# EAGLE design POC-save (EAGLE 7.6.0)
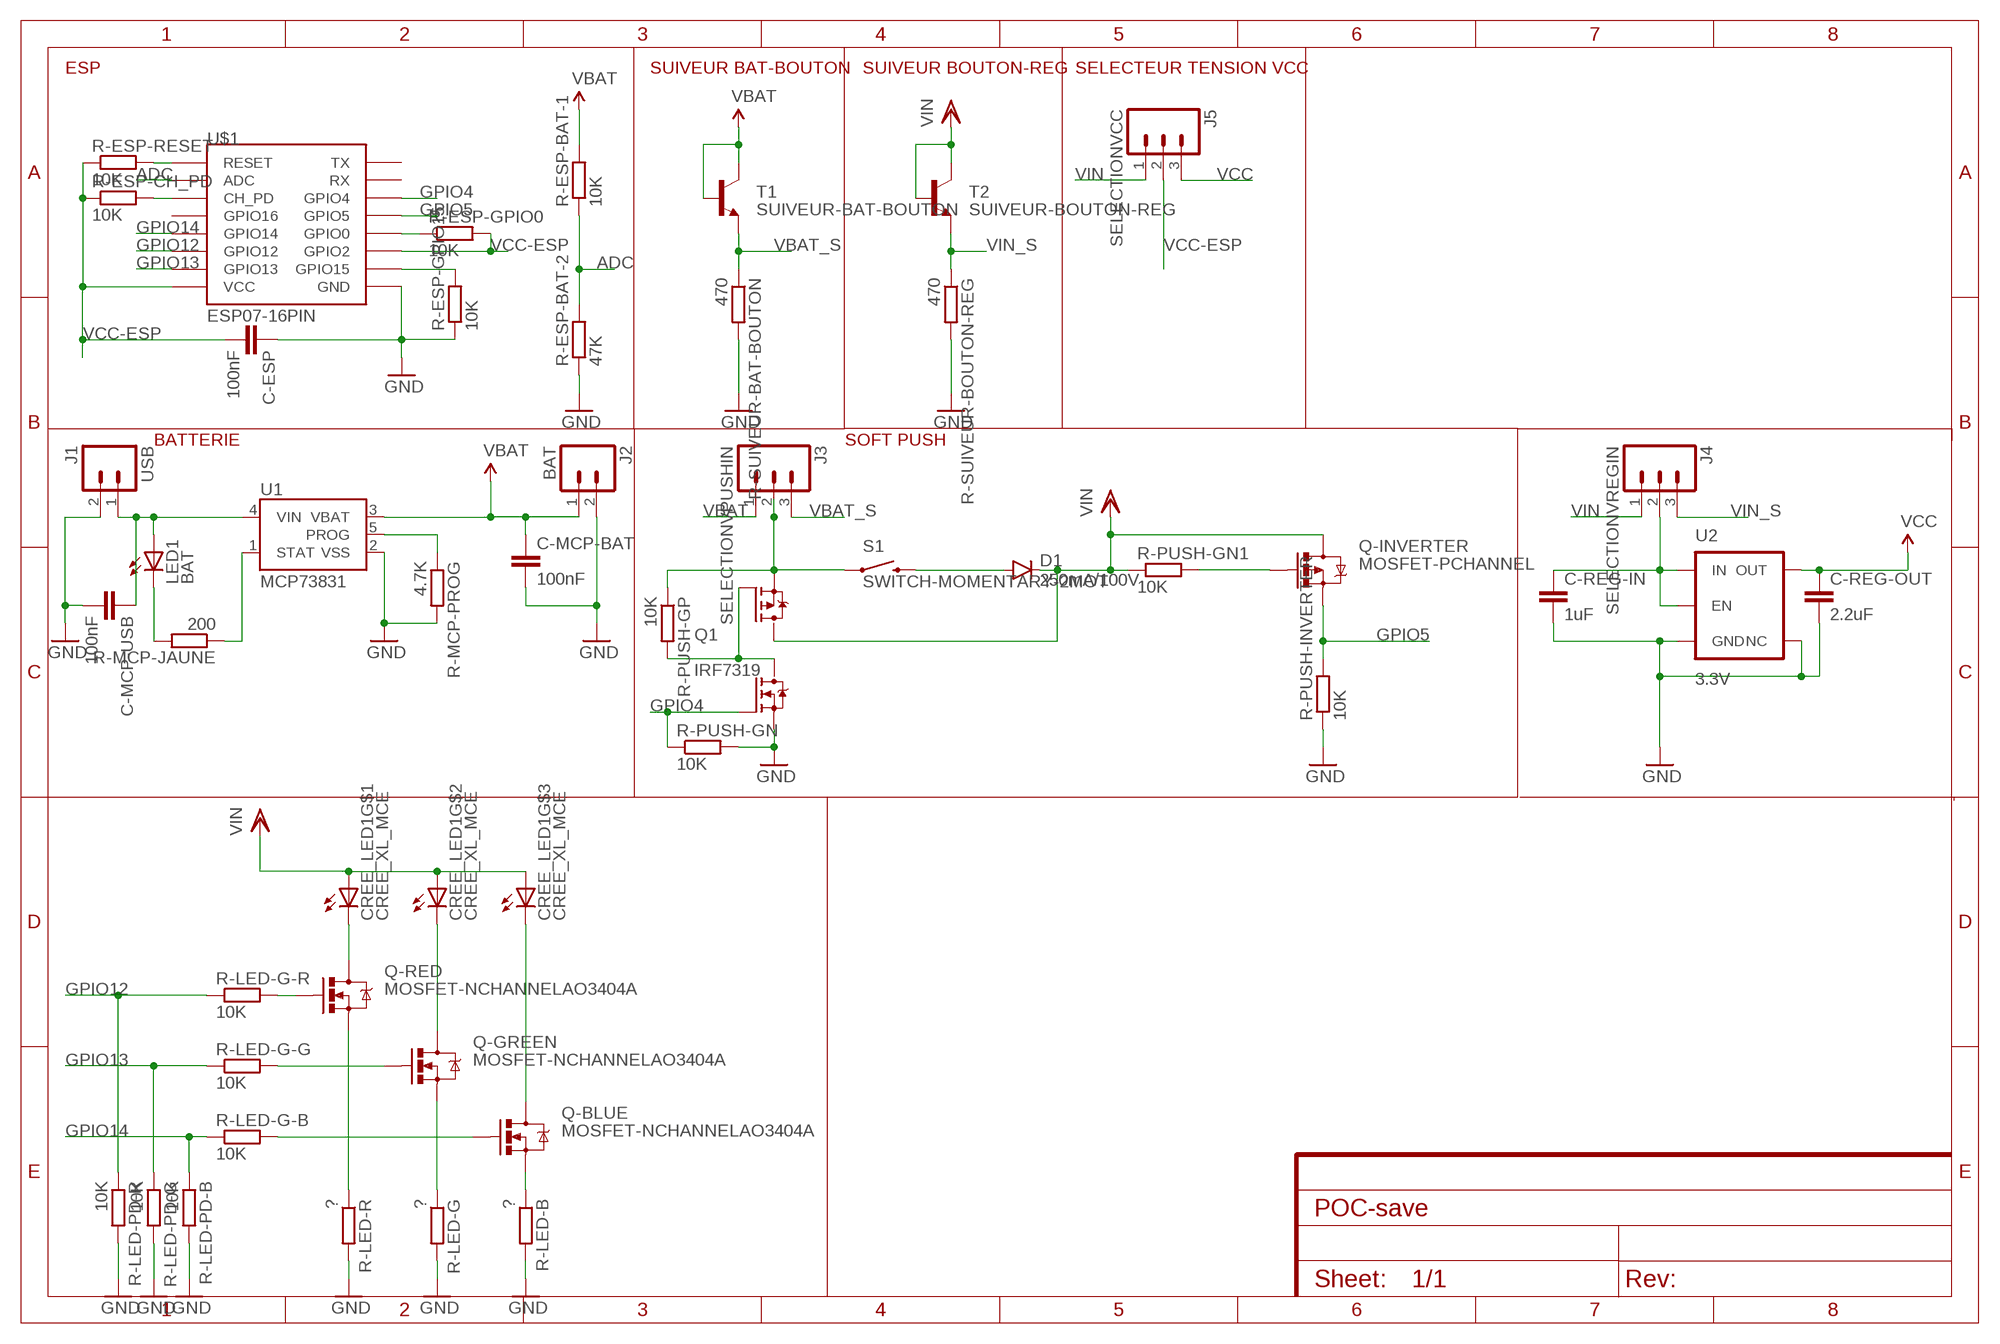
[diagram p0: schematic, sheet 1]

## Parts
C-ESP  100nF  C-EUC0805  [C0805]
C-MCP-BAT  100nF  C-EUC0805  [C0805]
C-MCP-USB  100nF  C-EUC0805  [C0805]
C-REG-IN  1uF  C-EUC0805  [C0805]
C-REG-OUT  2.2uF  C-EUC0805  [C0805]
CREE_LED1  CREE_XL_MCE  [CREE_XL_MCE]
D1  250mA/100V  DIODEBAS16  [SOD-323]
J1  USB  M02PTH  [1X02]
J2  BAT  M02PTH  [1X02]
J3  SELECTIONVPUSHIN  M03PTH  [1X03]
J4  SELECTIONVREGIN  M03PTH  [1X03]
J5  SELECTIONVCC  M03PTH  [1X03]
LED1  BAT  LEDCHIPLED_0805  [CHIPLED_0805]
Q1  IRF7319  [SO08-IRF]
Q-BLUE  MOSFET-NCHANNELAO3404A  [SOT23-3]
Q-GREEN  MOSFET-NCHANNELAO3404A  [SOT23-3]
Q-INVERTER  MOSFET-PCHANNEL  [SOT23-3]
Q-RED  MOSFET-NCHANNELAO3404A  [SOT23-3]
R-ESP-BAT-1  10K  R-EU_M0805  [M0805]
R-ESP-BAT-2  47K  R-EU_M0805  [M0805]
R-ESP-CH_PD  10K  R-EU_M0805  [M0805]
R-ESP-GPIO0  10K  R-EU_M0805  [M0805]
R-ESP-GPIO15  10K  R-EU_M0805  [M0805]
R-ESP-RESET  10K  R-EU_M0805  [M0805]
R-LED-B  ?  R-EU_M0805  [M0805]
R-LED-G  ?  R-EU_M0805  [M0805]
R-LED-G-B  10K  R-EU_M0805  [M0805]
R-LED-G-G  10K  R-EU_M0805  [M0805]
R-LED-G-R  10K  R-EU_M0805  [M0805]
R-LED-PD-B  10K  R-EU_M0805  [M0805]
R-LED-PD-G  10K  R-EU_M0805  [M0805]
R-LED-PD-R  10K  R-EU_M0805  [M0805]
R-LED-R  ?  R-EU_M0805  [M0805]
R-MCP-JAUNE  200  R-EU_M0805  [M0805]
R-MCP-PROG  4.7K  R-EU_M0805  [M0805]
R-PUSH-GN  10K  R-EU_M0805  [M0805]
R-PUSH-GN1  10K  R-EU_M0805  [M0805]
R-PUSH-GP  10K  R-EU_M0805  [M0805]
R-PUSH-INVERTER  10K  R-EU_M0805  [M0805]
R-SUIVEUR-BAT-BOUTON  470  R-EU_M0805  [M0805]
R-SUIVEUR-BOUTON-REG  470  R-EU_M0805  [M0805]
S1  SWITCH-MOMENTARY-2MOT  [TACTILE-PTH]
T1  SUIVEUR-BAT-BOUTON  TRANSISTOR_NPNSOT23-3  [SOT23-3]
T2  SUIVEUR-BOUTON-REG  TRANSISTOR_NPNSOT23-3  [SOT23-3]
U1  MCP73831  [SOT23-5]
U2  3.3V  V_REG_AP2112K-3.3V  [SOT23-5]
U$1  ESP07-16PIN  [ESP07-16PIN]

## Nets
ADC: R-ESP-BAT-1.1 R-ESP-BAT-2.2 U$1.ADC
GND: C-ESP.1 C-MCP-BAT.2 C-MCP-USB.2 C-REG-IN.2 C-REG-OUT.2 J1.2 J2.2 Q1.1(N-S) R-ESP-BAT-2.1 R-ESP-GPIO15.1 R-LED-B.2 R-LED-G.2 R-LED-PD-B.2 R-LED-PD-G.2 R-LED-PD-R.2 R-LED-R.2 R-MCP-PROG.2 R-PUSH-GN.2 R-PUSH-INVERTER.1 R-SUIVEUR-BAT-BOUTON.2 R-SUIVEUR-BOUTON-REG.2 U1.2(VSS) U2.2(GND) U2.4(NC) U$1.GND
GPIO4: Q1.2(N-G) R-PUSH-GN.1 U$1.GPIO4
GPIO5: Q-INVERTER.2(S) R-PUSH-INVERTER.2 U$1.GPIO5
GPIO12: R-LED-G-R.1 R-LED-PD-R.1 U$1.GPIO12
GPIO13: R-LED-G-G.1 R-LED-PD-G.1 U$1.GPIO13
GPIO14: R-LED-G-B.1 R-LED-PD-B.1 U$1.GPIO14
N$1: R-ESP-GPIO15.2 U$1.GPIO15
N$2: R-ESP-GPIO0.1 U$1.GPIO0
N$4: R-ESP-CH_PD.2 U$1.CH_PD
N$5: R-ESP-RESET.2 U$1.REST(RESET)
N$6: R-MCP-PROG.1 U1.5(PROG)
N$7: R-MCP-JAUNE.1 U1.1(STAT)
N$8: LED1.C R-MCP-JAUNE.2
N$9: Q1.4(P-G) Q1.7(N-D) Q1.8(N-D) R-PUSH-GP.2
N$10 [SUPPLY]: D1.A S1.4
N$11: Q-INVERTER.1(G) R-PUSH-GN1.2
N$12: C-REG-IN.1 J4.2 U2.1(IN) U2.3(EN)
N$13 [SUPPLY]: CREE_LED1.8(C) Q-RED.3(D)
N$14 [SUPPLY]: CREE_LED1.7(C) Q-GREEN.3(D)
N$15 [SUPPLY]: CREE_LED1.6(C) Q-BLUE.3(D)
N$18 [SUPPLY]: Q-BLUE.2(S) R-LED-B.1
N$19 [SUPPLY]: Q-GREEN.2(S) R-LED-G.1
N$20 [SUPPLY]: Q-RED.2(S) R-LED-R.1
N$21: Q-RED.1(G) R-LED-G-R.2
N$22: Q-GREEN.1(G) R-LED-G-G.2
N$23: Q-BLUE.1(G) R-LED-G-B.2
VBAT [SUPPLY]: C-MCP-BAT.1 J2.1 J3.1 R-ESP-BAT-1.2 T1.1(B) T1.3(C) U1.3(VBAT)
VBAT_S [SUPPLY]: J3.3 R-SUIVEUR-BAT-BOUTON.1 T1.2(E)
VCC [SUPPLY]: C-REG-OUT.1 J5.3 U2.5(OUT)
VCC-ESP [SUPPLY]: C-ESP.2 J5.2 R-ESP-CH_PD.1 R-ESP-GPIO0.2 R-ESP-RESET.1 U$1.GPIO2 U$1.VCC
VIN [SUPPLY]: CREE_LED1.1(A) CREE_LED1.2(A) CREE_LED1.3(A) D1.C J4.1 J5.1 Q1.5(P-D) Q1.6(P-D) Q-INVERTER.3(D) R-PUSH-GN1.1 T2.1(B) T2.3(C)
VIN_S [SUPPLY]: J4.3 R-SUIVEUR-BOUTON-REG.1 T2.2(E)
VPUSH_IN [SUPPLY]: J3.2 Q1.3(P-S) R-PUSH-GP.1 S1.1
VUSB [SUPPLY]: C-MCP-USB.1 J1.1 LED1.A U1.4(VIN)
Unconnected: CREE_LED1.4(A) CREE_LED1.5(C) CREE_LED1.HT(TH:TH) U$1.GPIO16 U$1.RX U$1.TX

## Notes on the sheet
- ESP | SUIVEUR BAT-BOUTON | SUIVEUR BOUTON-REG | SELECTEUR TENSION VCC
- BATTERIE | SOFT PUSH

## Library data of the parts
C-ESP C-MCP-BAT C-MCP-USB C-REG-IN C-REG-OUT = resistor:C-EU: CAPACITOR, European symbol
CREE_LED1 = CreeXL-MC-E:CREE_XL_MCE: Cree® LED
D1 = SparkFun-DiscreteSemi:DIODE: Diode These are standard reverse protection diodes and small signal diodes. SMA package can handle up to about 1A. SOD-323 can handle about 200mA. What the SOD-323 package when ordering, there are some mfgs out there that are 5-pin packages.; PROD_ID: DIO-09646
J1 J2 = SparkFun-Connectors:M02: Standard 2-pin 0.1" header. Use with - straight break away headers ( PRT-00116) - right angle break away headers (PRT-00553) - swiss pins (PRT-00743) - machine pins (PRT-00117) - female headers (PRT-00115) Molex polarized connector foot print use with: PRT-08233 with associated crimp pins and housings. 2.54_SCREWTERM for use with PRT-10571. 3.5mm Screw Terminal footprints for PRT-08084 5mm Screw Terminal footprints for use with PRT-08432
J3-J5 = SparkFun-Connectors:M03: Header 3 Standard 3-pin 0.1" header. Use with straight break away headers (SKU : PRT-00116), right angle break away headers (PRT-00553), swiss pins (PRT-00743), machine pins (PRT-00117), and female headers (PRT-00115). Molex polarized connector foot print use with SKU : PRT-08232 with associated crimp pins and housings.
LED1 = led:LED: LED OSRAM: - CHIPLED LG R971, LG N971, LY N971, LG Q971, LY Q971, LO R971, LY R971 LH N974, LH R974 LS Q976, LO Q976, LY Q976 LO Q996 - Hyper CHIPLED LW Q18S LB Q993, LB Q99A, LB R99A - SideLED LS A670, LO A670, LY A670, LG A670, LP A670 LB A673, LV A673, LT A673, LW A673 LH A674 LY A675 LS A676, LA A676, LO A676, LY A676, LW A676 LS A679, LY A679, LG A679 - Hyper Micro SIDELED® LS Y876, LA Y876, LO Y876, LY Y876 LT Y87S - SmartLED LW L88C, LW L88S LB L89C, LB L89S, LG L890 LS L89K, LO L89K, LY L89K LS L896, LA L896, LO L896, LY L896 - TOPLED LS T670, LO T670, LY T670, LG T670, LP T670 LSG T670, LSP T670, LSY T670, LOP T670, LYG T670 LG T671, LOG T671, LSG T671 LB T673, LV T673, LT T673, LW T673 LH T674 LS T676, LA T676, LO T676, LY T676, LB T676, LH T676, LSB T676, LW T676 LB T67C, LV T67C, LT T67C, LS T67K, LO T67K, LY T67K, LW E67C LS E67B, LA E67B, LO E67B, LY E67B, LB E67C, LV E67C, LT E67C LW T67C LS T679, LY T679, LG T679 LS T770, LO T770, LY T770, LG T770, LP T770 LB T773, LV T773, LT T773, LW T773 LH T774 LS E675, LA E675, LY E675, LS T675 LS T776, LA T776, LO T776, LY T776, LB T776 LHGB T686 LT T68C, LB T68C - Hyper Mini TOPLED® LB M676 - Mini TOPLED Santana® LG M470 LS M47K, LO M47K, LY M47K Source: http://www.osram.convergy.de LUXEON: - LUMILED® LXK2-PW12-R00, LXK2-PW12-S00, LXK2-PW14-U00, LXK2-PW14-V00 LXK2-PM12-R00, LXK2-PM12-S00, LXK2-PM14-U00 LXK2-PE12-Q00, LXK2-PE12-R00, LXK2-PE12-S00, LXK2-PE14-T00, LXK2-PE14-U00 LXK2-PB12-K00, LXK2-PB12-L00, LXK2-PB12-M00, LXK2-PB14-N00, LXK2-PB14-P00, LXK2-PB14-Q00 LXK2-PR12-L00, LXK2-PR12-M00, LXK2-PR14-Q00, LXK2-PR14-R00 LXK2-PD12-Q00, LXK2-PD12-R00, LXK2-PD12-S00 LXK2-PH12-R00, LXK2-PH12-S00 LXK2-PL12-P00, LXK2-PL12-Q00, LXK2-PL12-R00 Source: www.luxeon.com KINGBRIGHT: KA-3528ASYC Source: www.kingbright.com
Q1 = lio:IRF7319: Complimentary Half Bridge HEXFET Power MOSFET Source: http://www.irf.com/product-info/datasheets/data/irf7319.pdf
Q-BLUE Q-GREEN Q-RED = SparkFun-DiscreteSemi:MOSFET-NCHANNEL: Common NMOSFET Parts MFG P/N Store ID Prod ID FDD8780 TRANS-09984 SI7820DN TRANS-11055 FDS6630A IC-08089 2N7002PW TRANS-11151 FQP30N06L COM-10213 TRANS-10060 BSS123LT1G TRANS-08345 BSS138 TRANS-00830 BS170 2N7000; PROD_ID: TRAN-12988
Q-INVERTER = SparkFun-DiscreteSemi:MOSFET-PCHANNEL: Generic PMOSFET IRLML2244 - TRANS-11153 (SOT-23 -20V -4.3A) (1.Gate 2.Source 3.Drain) FQP27P06 - COM-10349 <http://www.sparkfun.com/products/10349> (TO-220 -60V -27A) (1.Gate 2.Source 3.Drain); PROD_ID: TRANS-08285
R-ESP-BAT-1 R-ESP-BAT-2 R-ESP-CH_PD R-ESP-GPIO0 R-ESP-GPIO15 R-ESP-RESET R-LED-B R-LED-G R-LED-G-B R-LED-G-G R-LED-G-R R-LED-PD-B R-LED-PD-G R-LED-PD-R R-LED-R R-MCP-JAUNE R-MCP-PROG R-PUSH-GN R-PUSH-GN1 R-PUSH-GP R-PUSH-INVERTER R-SUIVEUR-BAT-BOUTON R-SUIVEUR-BOUTON-REG = resistor:R-EU_: RESISTOR, European symbol
S1 = SparkFun-Electromechanical:SWITCH-MOMENTARY-2: Various NO switches- pushbuttons, reed, etc
T1 T2 = SparkFun-DiscreteSemi:TRANSISTOR_NPN: Generic NPN BJT MMBT2222A - TRANS-08049 (SOT-23, 1A 40V) MPSA42 - TRANS-09116 (SOT-23, 500mA 300V) MMBT5088LT1G - TRANS-11160 (SOT-23, 50 mA 30V) BC547 - COM-08928 <http://www.sparkfun.com/products/8928> (TO-92 45V 100mA) (1.Collector 2.Base 3.Emitter) 2N3904 - COM-00521 <http://www.sparkfun.com/products/521> (TO-92 40V 200mA) (1.Emitter 2.Base 3.Collector) P2N2222A - COM-12852 <http://www.sparkfun.com/products/12852> (TO-92 40V 600mA) (1.Collector 2.Base 3.Emitter); PROD_ID: TRANS-08049
U1 = SparkFun-PowerIC:MCP73831: Miniature single cell, fully integrated Li-Ion, Li-polymer charge management controller http://ww1.microchip.com/downloads/en/DeviceDoc/20001984g.pdf IC-09995; PROD_ID: IC-09995
U2 = SparkFun-PowerIC:V_REG_AP2112: AP2112 - 600mA CMOS LDO Regulator w/ Enable The AP2112 is CMOS process low dropout linear regulator with enable function, the regulator delivers a guaranteed 600mA (min.) continuous load current. Features Output Voltage Accuracy: ±1.5% Output Current: 600mA (Min.) Foldback Short Current Protection: 50mA Enable Function to Turn ON/OFF VOUT Low Dropout Voltage (3.3V): 250mV (Typ.) @IOUT=600mA Excellent Load Regulation: 0.2%/A (Typ.) Excellent Line Regulation: 0.02%/V (Typ.) Low Quiescent Current: 55μA (Typ.) Low Standby Current: 0.01μA (Typ.) Low Output Noise: 50μVRMS PSRR: 100Hz -65dB, 1kHz -65dB OTSD Protection Stable with 1.0μF Flexible Cap: Ceramic, Tantalum and Aluminum Electrolytic Operation Temperature Range: -40°C to 85°C ESD: MM 400V, HBM 4000V; PROD_ID: VREG-12457
U$1 = esp8266modules:ESP07-16PIN: ESP8266 Wifi module 07 - 16 pins; DIMENSIONS: 22.0 x 16.0 mm; PINS: 16; PITCH: 0.078" / 2 mm

## Net classes
1 SUPPLY: width 0.5 mm, drill 0.2 mm, clearance 0.5 mm

## Board
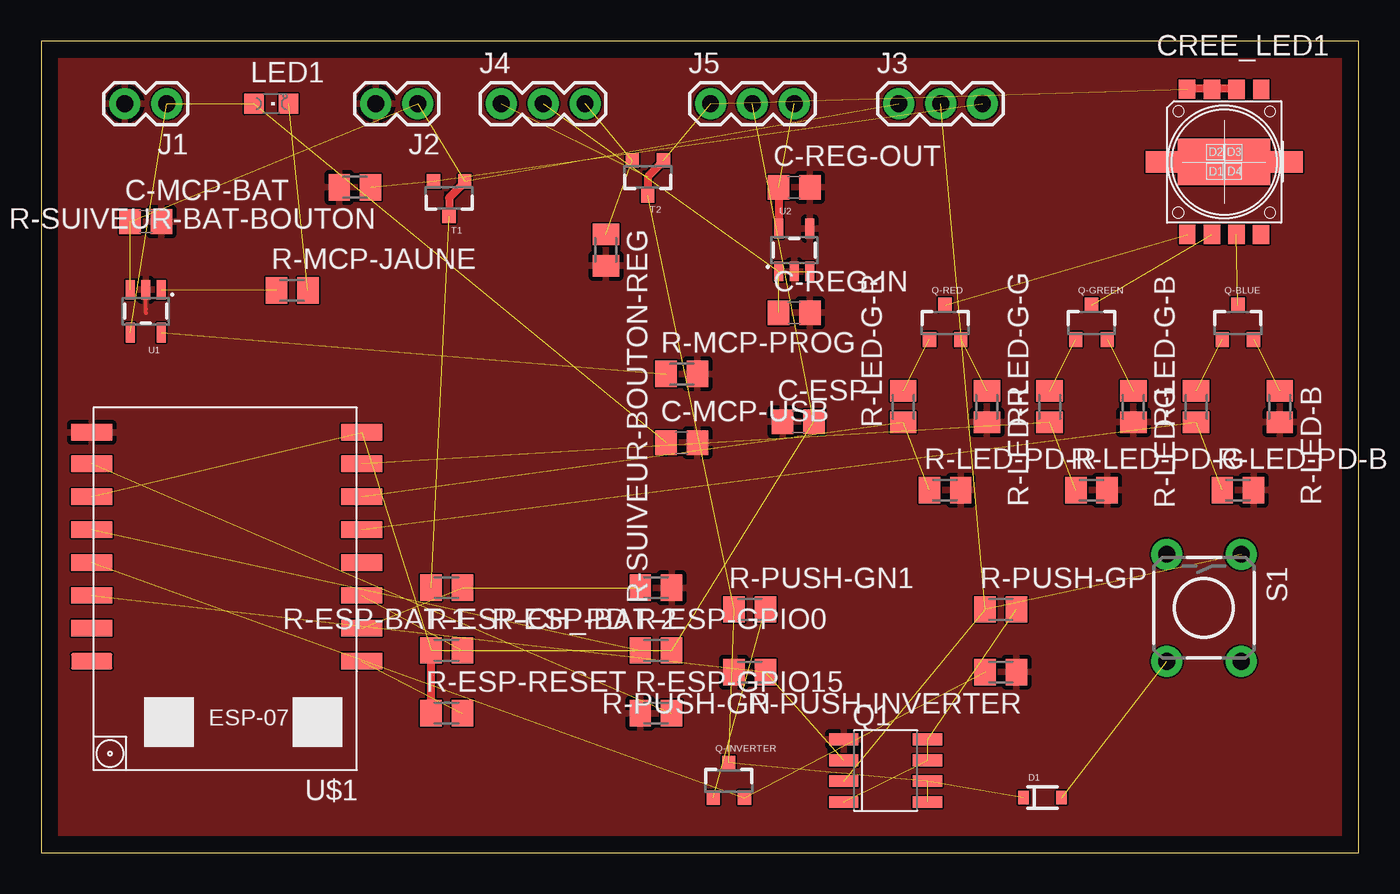
[diagram p1: board, top side]
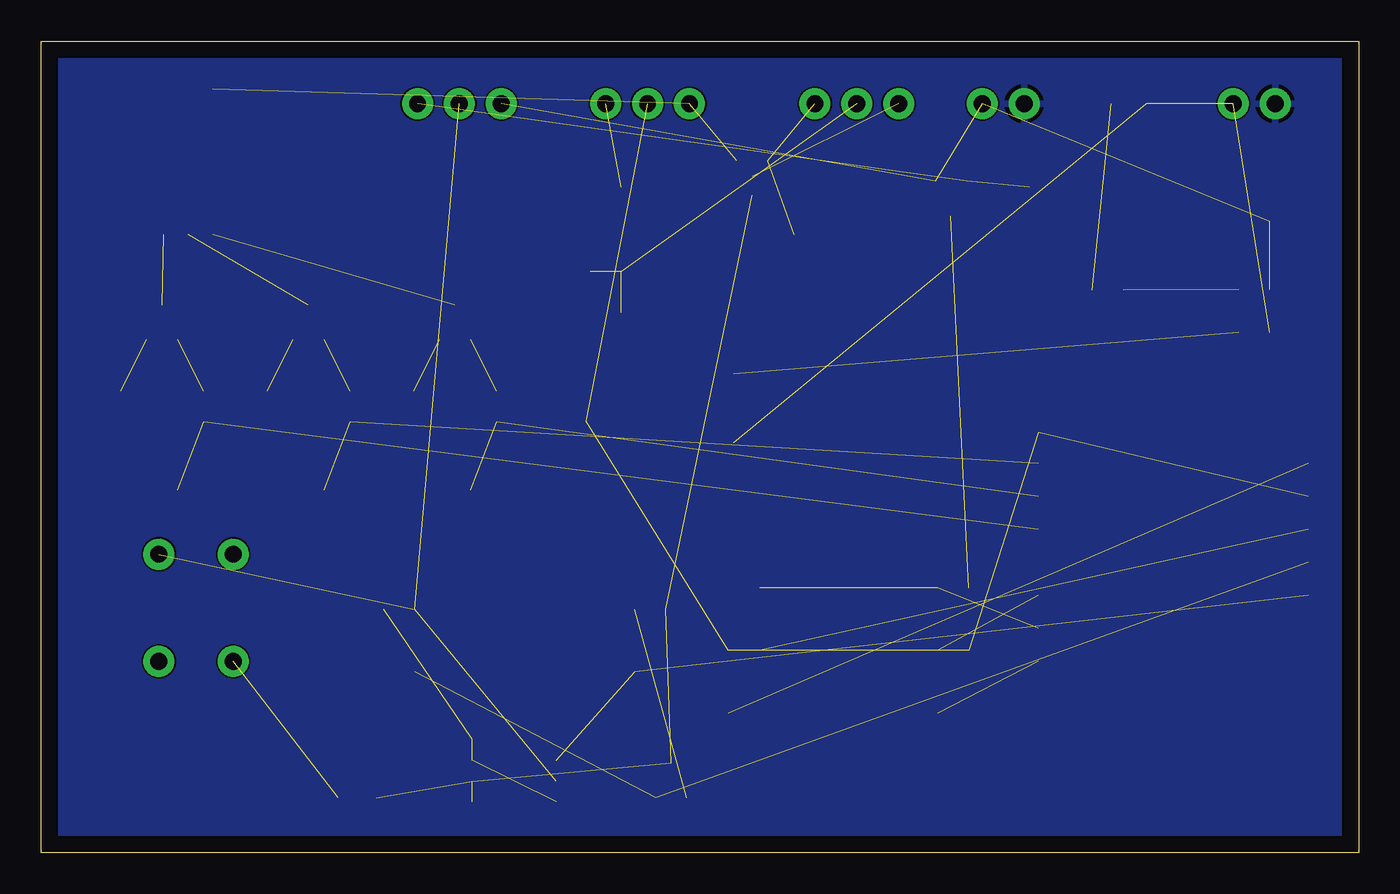
[diagram p2: board, bottom side, seen from below]

Size 80 x 49.3 mm. Coordinates in mm from the lower left corner, seen from the top.
Outline: 0,0 80,0 80,49.3 0,49.3 0,0
Copper layers (1*16): Top 0.035mm / dielectric 1.5mm / Bottom 0.035mm
Design rules "baballe": minimum track width 5mil, minimum drill 24mil, track to track 4mil, track to pad 4mil, pad to pad 4mil, via to via 4mil, smd to smd 2mil, copper to edge 40mil, drill to drill 8mil, minimum pad ring 10mil, minimum via ring 8mil, stop-mask expansion 4mil, vias tented up to drill 0mil, thermal gap 10mil

### Footprints (pad centres in the part's own frame; a part is rotated, then mirrored left to right if it is on the bottom)
C0805 = smd 1.3 x 1.5: 1 -0.95,0; 2 0.95,0
CREE_XL_MCE = smd 1 x 1.16: 1 -2.24,4.42; 2 -0.739,4.408; 3 0.739,4.408; 4 2.256,4.408; 5 2.246,-4.408; 6 0.749,-4.399; 7 -0.739,-4.399; 8 -2.237,-4.399 | smd 5.6 x 2.84: HT 0,0 | smd 2 x 1.3: P$9 3.778,0; P$10 -3.767,0
SOD-323 = smd 0.63 x 0.83: A 1.15,0; C -1.15,0
1X02 = drill 1.016 pad 1.88: 1 0,0; 2 2.54,0
1X03 = drill 1.016 pad 1.88: 1 0,0; 2 2.54,0; 3 5.08,0
CHIPLED_0805 = smd 1.2 x 1.2: A 0,-1.05; C 0,1.05
SO08-IRF = smd 0.72 x 1.78: 1 -1.905,-2.543; 2 -0.635,-2.543; 3 0.635,-2.543; 4 1.905,-2.543; 5 1.905,2.543; 6 0.635,2.543; 7 -0.635,2.543; 8 -1.905,2.543
SOT23-3 = smd 0.8 x 0.9: 1 -0.95,-1; 2 0.95,-1; 3 0,1.1
M0805 = smd 1.3 x 1.6: 1 -0.95,0; 2 0.95,0
TACTILE-PTH = drill 1.016 pad 1.88: 1 -3.251,2.261; 2 3.251,2.261; 3 -3.251,-2.261; 4 3.251,-2.261
SOT23-5 = smd 0.55 x 1.2: 1 -0.95,-1.3; 2 0,-1.3; 3 0.95,-1.3; 4 0.95,1.3; 5 -0.95,1.3
ESP07-16PIN = smd 2.5 x 1: ADC -8.2,3.8; CH_PD -8.2,1.8; GND 8.2,-8.105; GPIO0 8.2,-2.2; GPIO2 8.2,-4.2; GPIO4 8.2,1.8; GPIO5 8.2,-0.2; GPIO12 -8.2,-4.2; GPIO13 -8.2,-6.2; GPIO14 -8.2,-2.2; GPIO15 8.2,-6.2; GPIO16 -8.2,-0.2; REST -8.2,5.8; RX 8.2,3.8; TX 8.2,5.8; VCC -8.2,-8.105

### Placement (x,y rotation side)
C-ESP  45.97,26.18 0 top
C-MCP-BAT  6.35,38.34 0 top
C-MCP-USB  38.89,24.91 0 top
C-REG-IN  45.72,32.8 0 top
C-REG-OUT  45.72,40.42 0 top
CREE_LED1  71.82,41.96 0 top
D1  60.8,3.35 0 top
J1  7.62,45.5 180 top
J2  22.86,45.5 180 top
J3  52.07,45.5 0 top
J4  27.94,45.5 0 top
J5  40.64,45.5 0 top
LED1  13.97,45.5 270 top
Q1  51.27,4.99 270 top
Q-BLUE  72.66,32.18 0 top
Q-GREEN  63.77,32.18 0 top
Q-INVERTER  41.75,4.35 0 top
Q-RED  54.88,32.18 0 top
R-ESP-BAT-1  24.62,16.1 180 top
R-ESP-BAT-2  37.32,16.1 180 top
R-ESP-CH_PD  24.62,12.29 0 top
R-ESP-GPIO0  37.32,12.29 0 top
R-ESP-GPIO15  37.32,8.48 0 top
R-ESP-RESET  24.62,8.48 0 top
R-LED-B  75.2,27.1 270 top
R-LED-G  66.31,27.1 270 top
R-LED-G-B  70.12,27.1 90 top
R-LED-G-G  61.23,27.1 90 top
R-LED-G-R  52.34,27.1 90 top
R-LED-PD-B  72.66,22.02 0 top
R-LED-PD-G  63.77,22.02 0 top
R-LED-PD-R  54.88,22.02 0 top
R-LED-R  57.42,27.1 270 top
R-MCP-JAUNE  15.24,34.16 0 top
R-MCP-PROG  38.89,29.08 0 top
R-PUSH-GN  43.02,10.97 180 top
R-PUSH-GN1  43.02,14.78 0 top
R-PUSH-GP  58.26,14.78 0 top
R-PUSH-INVERTER  58.26,10.97 180 top
R-SUIVEUR-BAT-BOUTON  19.05,40.42 180 top
R-SUIVEUR-BOUTON-REG  34.29,36.61 270 top
S1  70.59,14.88 270 top
T1  24.77,39.78 180 top
T2  36.83,41.05 180 top
U1  6.35,32.89 180 top
U2  45.72,36.61 0 top
U$1  11.27,17.43 180 top

### Tracks (layer width: path | path; a pad name or v marks a point on that pad's centre or on a via)
ADC  (2 unrouted)
GND
  Top 0.254: U1.2 6.35,32.8 6.35,33
  pour Bottom: 0,49.31 80.01,49.31 80.01,0 0,0
  pour Top: 0,49.31 80.01,49.31 80.01,0 0,0
GPIO4  (2 unrouted)
GPIO5  (2 unrouted)
GPIO12  (2 unrouted)
  Top 0.254: R-LED-G-R.1
GPIO13  (2 unrouted)
GPIO14  (2 unrouted)
N$1  (1 unrouted)
N$2  (1 unrouted)
N$4  (1 unrouted)
N$5  (1 unrouted)
N$6  (1 unrouted)
N$7  (1 unrouted)
N$8  (1 unrouted)
N$9  (3 unrouted)
N$10  (1 unrouted)
N$11  (1 unrouted)
N$12  (3 unrouted)
N$13  (1 unrouted)
N$14  (1 unrouted)
N$15  (1 unrouted)
N$18  (1 unrouted)
N$19  (1 unrouted)
N$20  (1 unrouted)
N$21  (1 unrouted)
N$22  (1 unrouted)
N$23  (1 unrouted)
VBAT  (5 unrouted)
  Top 0.5: T1.3 24.77,39.78 25.72,40.74 T1.1
VBAT_S  (2 unrouted)
VCC  (1 unrouted)
  Top 0.5: U2.5 44.77,38.2 C-REG-OUT.1
VCC-ESP  (5 unrouted)
  Top 0.5: R-ESP-RESET.1 R-ESP-CH_PD.1
VIN  (8 unrouted)
  Top 0.5: CREE_LED1.1 69.85,46.45 70.8,46.45 CREE_LED1.2 71.12,46.45 72.39,46.45 CREE_LED1.3 | T2.3 36.83,41.05 37.78,42.01 T2.1
VIN_S  (2 unrouted)
VPUSH_IN  (3 unrouted)
VUSB  (3 unrouted)